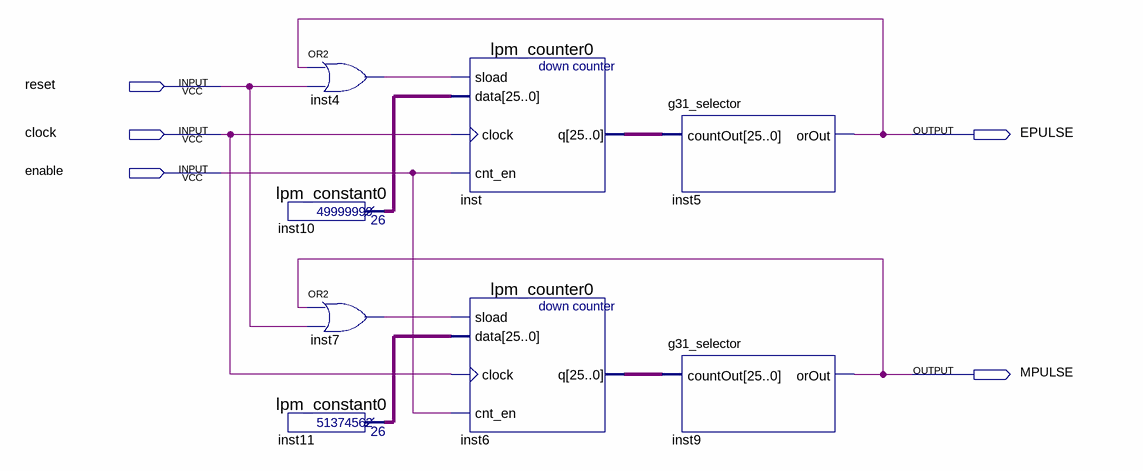
[diagram p0: schematic sheet]
// Quartus schematic g31_basic_timer_schematic.bdf as structural Verilog: 8 symbols, 5 pins
module g31_basic_timer_schematic (
  input  reset,
  input  clock,
  input  enable,
  output EPULSE,
  output MPULSE
);

  wire inst4_out, inst7_out;
  wire [25:0] inst6_q, inst10_result, inst11_result, inst_q;

  or inst4 (inst4_out, EPULSE, reset);
  lpm_constant0 inst10 (.result(inst10_result));
  or inst7 (inst7_out, MPULSE, reset);
  lpm_constant0 inst11 (.result(inst11_result));
  lpm_counter0 inst (.sload(inst4_out), .data(inst10_result), .clock(clock), .cnt_en(enable), .q(inst_q));
  lpm_counter0 inst6 (.sload(inst7_out), .data(inst11_result), .clock(clock), .cnt_en(enable), .q(inst6_q));
  g31_selector inst5 (.countOut(inst_q), .orOut(EPULSE));
  g31_selector inst9 (.countOut(inst6_q), .orOut(MPULSE));
endmodule
